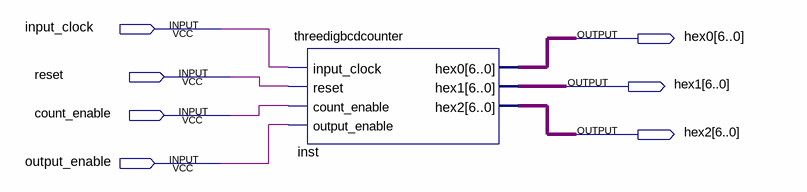
[diagram p0: schematic sheet]
// Quartus schematic 3CountEnableClock.bdf as structural Verilog: 1 symbols, 7 pins
module \3CountEnableClock  (
  input  input_clock,
  input  reset,
  input  count_enable,
  input  output_enable,
  output [6:0] hex0,
  output [6:0] hex1,
  output [6:0] hex2
);

  threedigbcdcounter inst (
    .input_clock(input_clock), .reset(reset), .count_enable(count_enable), .output_enable(output_enable),
    .hex0(hex0), .hex1(hex1), .hex2(hex2));
endmodule
